# EAGLE design 1551H-RS485 to Neopixel with RJ45 (EAGLE 9.4.2)
RS485 over Ethernet to NeoPixel for Hammond 1551H enclosure
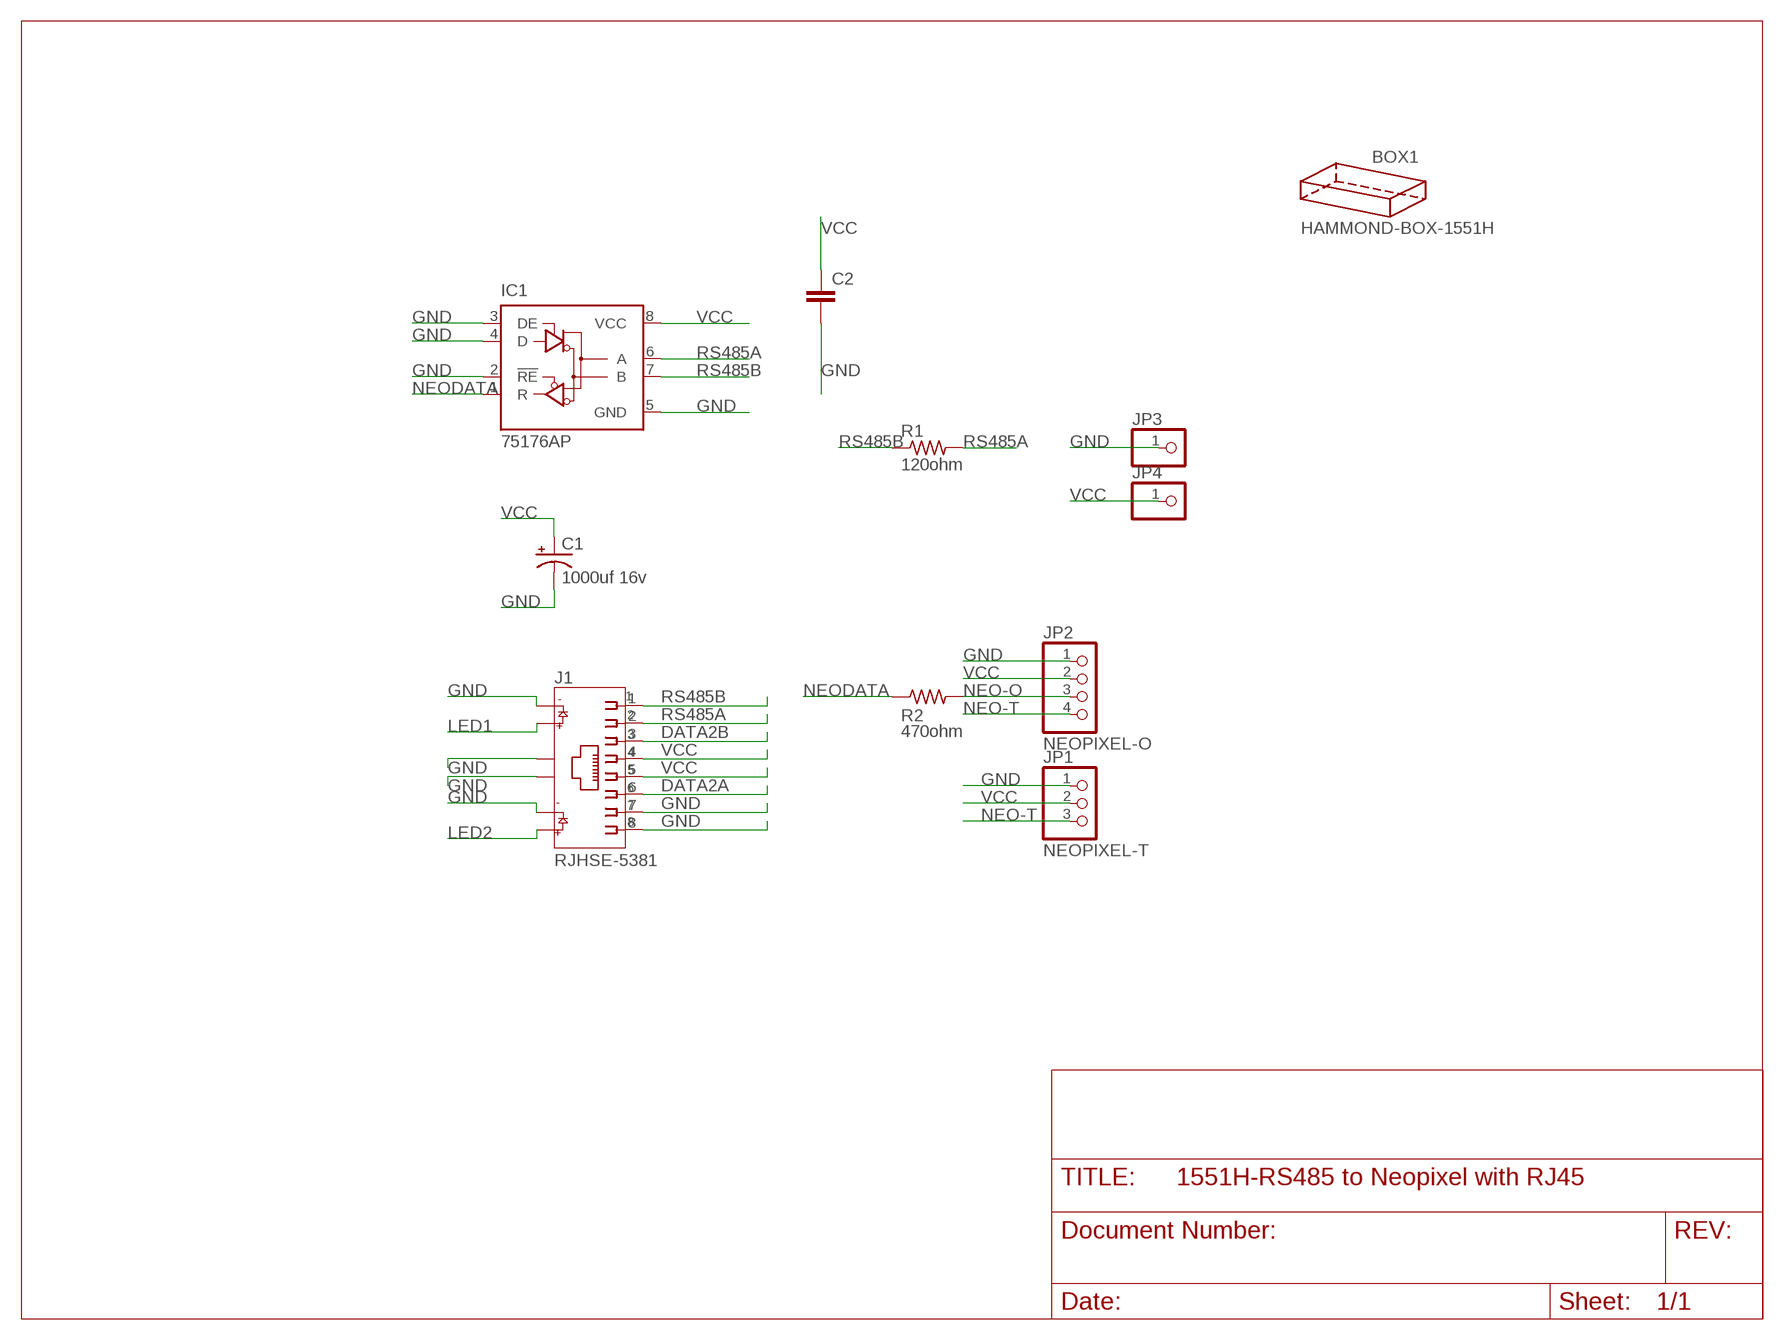
[diagram p0: schematic, sheet 1]

## Parts
BOX1  HAMMOND-BOX-1551H  [1551H]
C1  1000uf 16v  1000UF-RADIAL-5MM-25V-20%  [CPOL-RADIAL-5MM-10MM]
C2  CAPACITOR_0805_N  [RESC0805_N]
IC1  75176AP  [DIL08]
J1  RJHSE-5381  [AMPHENOL_RJHSE-5381]
JP1  NEOPIXEL-T  PINHD-1X3  [1X03]
JP2  NEOPIXEL-O  PINHD-1X4  [1X04]
JP3  PINHD-1X1  [1X01]
JP4  PINHD-1X1  [1X01]
R1  120ohm  R-US_R0805  [R0805]
R2  470ohm  R-US_R0805  [R0805]

## Nets
DATA2A: J1.6
DATA2B: J1.3
GND: C1.- C2.2 IC1.2(!RE) IC1.3(DE) IC1.4(D) IC1.5(GND) J1.7 J1.8 J1.9 J1.11 J1.S1 J1.S2 JP1.1 JP2.1 JP3.1
LED1: J1.10
LED2: J1.12
NEO-O: JP2.3 R2.2
NEO-T: JP1.3 JP2.4
NEODATA: IC1.1(R) R2.1
RS485A: IC1.6(A) J1.2 R1.2
RS485B: IC1.7(B) J1.1 R1.1
VCC: C1.+ C2.1 IC1.8(VCC) J1.4 J1.5 JP1.2 JP2.2 JP4.1

## Library data of the parts
BOX1 = hammond:HAMMOND-BOX: Hammond Project boxes Hammond 1551 Transluscent Blue 50x35x20mm 1551GTBU http://www.hammondmfg.com/pdf/1551G.pdf Hammond 1551 Transluscent Blue 50x50x20mm 1551RTBU http://www.hammondmfg.com/pdf/1551R.pdf Hammond 1551 Transluscent Blue 60x35x20mm 1551HTBU http://www.hammondmfg.com/pdf/1551H.pdf Hammond 1551 Transluscent Blue 80x40x20mm 1551KTBU http://www.hammondmfg.com/pdf/1551K.pdf Hammond 1591 Transluscent Blue 100x51x22mm 1591XXATBU http://www.hammondmfg.com/pdf/1591XXA.pdf Hammond 1553B 117x79x24mm 1553B__BK http://www.hammondmfg.com/pdf/1553B.pdf Hammond 1553D 147x78x24mm 1553B__BK http://www.hammondmfg.com/pdf/1553C.pdf
C1 = SparkFun-Capacitors:1000UF: 1,000µF/1mF ceramic capacitors A capacitor is a passive two-terminal electrical component used to store electrical energy temporarily in an electric field. CAP-08070; PROD_ID: CAP-09538; VALUE: 1mF
C2 = Nordic_nRF:CAPACITOR: Generic chip capacitor
IC1 = 751xx:75176A: DIFFERENTIAL BUS TRANSCEIVER Source: http://focus.ti.com/lit/ds/symlink/sn75176a.pdf
J1 = RJHSE-5381:RJHSE-5381: connector, mod jack, rt angle pcb, shielded, led1-g, led2-y, single port, rj-45 8 cont; AVAILABILITY: Unavailable; DESCRIPTION: connector, mod jack, rt angle pcb, shielded, led1-g, led2-y, single port, rj-45 8 cont; MF: Amphenol ICC; MP: RJHSE-5381; PACKAGE: None; PRICE: None
JP1 = pinhead:PINHD-1X3: PIN HEADER
JP2 = pinhead:PINHD-1X4: PIN HEADER
JP3 JP4 = pinhead:PINHD-1X1: PIN HEADER
R1 R2 = rcl:R-US_: RESISTOR, American symbol; SPICEPREFIX: R

## Board
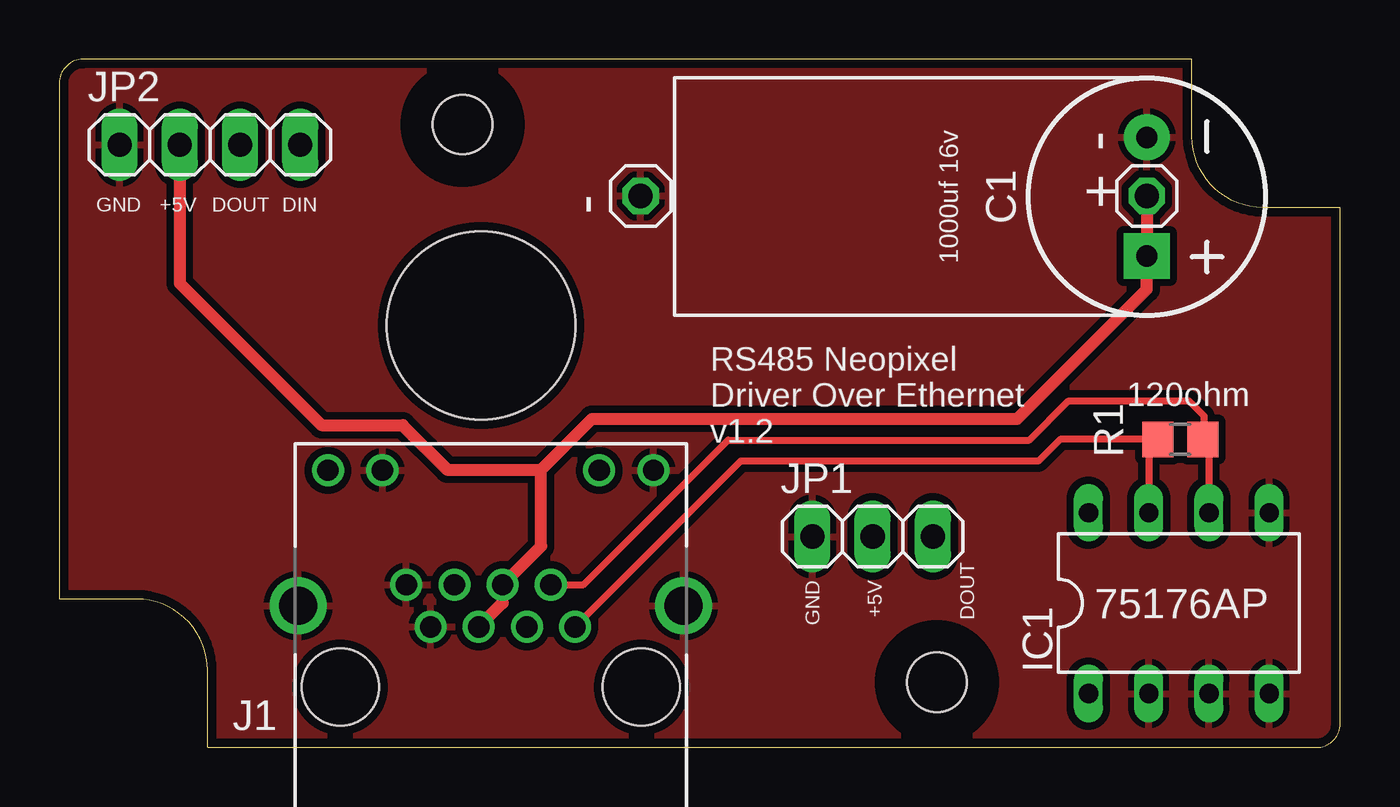
[diagram p1: board, top side]
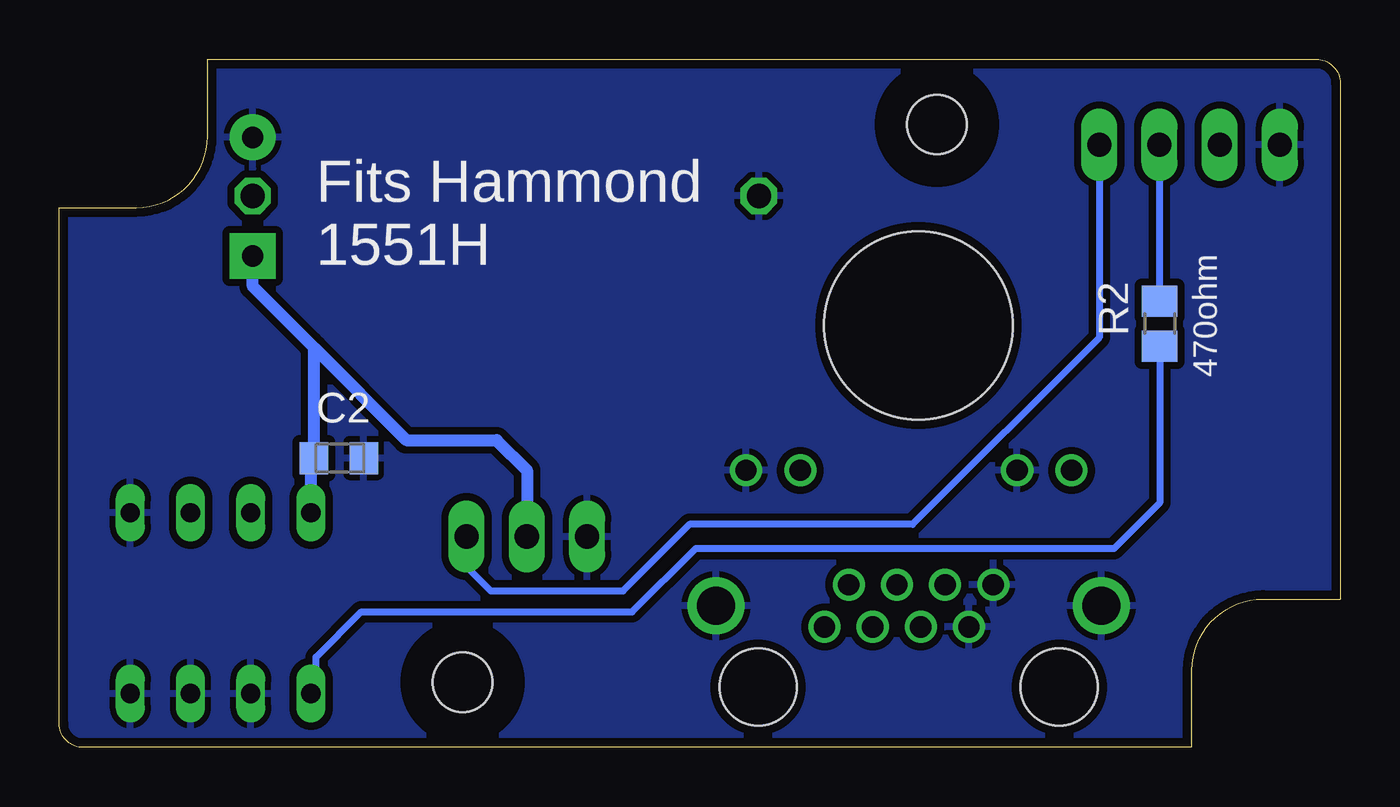
[diagram p2: board, bottom side, seen from below]

Size 54 x 29 mm. Coordinates in mm from the lower left corner, seen from the top.
Copper layers (1*16): Top 0.035559375mm / dielectric 1.6mm / Bottom 0.035559375mm
Design rules "oshpark-2layer": minimum track width 6mil, minimum drill 10mil, track to track 6mil, track to pad 6mil, pad to pad 6mil, via to via 6mil, smd to smd 6mil, copper to edge 15mil, drill to drill 6mil, minimum pad ring 5mil, minimum via ring 5mil, stop-mask expansion 2.5mil, vias tented up to drill 0mil, thermal gap 10mil
Holes 7.94 mm at 17.78,17.78

### Footprints (pad centres in the part's own frame; a part is rotated, then mirrored left to right if it is on the bottom)
1551H = hole 2.5: 37,2.75; 17,26.25
CPOL-RADIAL-5MM-10MM = drill 0.9 pad 1.93 square: + 2.5,0 | drill 0.9 pad 1.93: - -2.5,0
RESC0805_N = smd 1.2 x 1.35: 1 -1.1,0; 2 1,0
DIL08 = drill 0.813 long: 1 -3.81,-3.81; 2 -1.27,-3.81; 3 1.27,-3.81; 4 3.81,-3.81; 5 3.81,3.81; 6 1.27,3.81; 7 -1.27,3.81; 8 -3.81,3.81
AMPHENOL_RJHSE-5381 = drill 0.9: 1 3.55,2.54; 2 2.53,4.32; 3 1.52,2.54; 4 0.5,4.32; 5 -0.51,2.54; 6 -1.53,4.32; 7 -2.54,2.54; 8 -3.56,4.32; 9 6.86,9.14; 10 4.57,9.14; 11 -4.57,9.14; 12 -6.86,9.14 | drill 1.6: S1 8.13,3.43; S2 -8.13,3.43 | hole 3.25: 6.35,0; -6.35,0
1X03 = drill 1.016 long: 1 -2.54,0; 2 0,0; 3 2.54,0
1X04 = drill 1.016 long: 1 -3.81,0; 2 -1.27,0; 3 1.27,0; 4 3.81,0
1X01 = drill 1.016 octagon: 1 0,0
R0805 = smd 1.3 x 1.5: 1 -0.95,0; 2 0.95,0

### Placement (x,y rotation side)
BOX1  0,0 0 top
C1  45.85,23.21 270 top
C2  42.16,12.19 0 bottom
IC1  47.2,6.08 0 top
J1  18.19,2.54 0 top
JP1  34.29,8.89 0 top
JP2  6.35,25.4 0 top
JP3  24.51,23.24 0 top
JP4  45.85,23.24 0 top
R1  47.26,12.98 0 top
R2  7.61,17.86 90 bottom

### Tracks (layer width: path | path; a pad name or v marks a point on that pad's centre or on a via)
GND
  pour Bottom (isolate 0.305): 0,29.21 54.61,29.21 54.61,3.81 55.88,2.54 55.88,0 0,0
  pour Top (isolate 0.305): 0,29.21 54.61,29.21 54.61,0 0,0
NEO-O
  Bottom 0.305: R2.2 7.62,18.82 JP2.3
NEO-T
  Bottom 0.305: JP2.4 10.16,17.27 18.03,9.4 27.43,9.4 30.23,6.6 35.81,6.6 36.83,7.62 JP1.3
NEODATA
  Bottom 0.305: R2.1 7.61,10.31 9.53,8.38 27.18,8.38 29.84,5.71 41.27,5.71 43.18,3.81 43.18,2.48 IC1.1
RS485A
  Top 0.305: J1.2 22.1,6.86 28.19,12.95 40.89,12.95 42.55,14.61 47.62,14.61 48.26,13.97 48.26,13.04 R1.2 48.47,12.72 IC1.6
RS485B
  Top 0.305: J1.1 28.73,12.06 41.27,12.06 42.2,12.98 R1.1 45.93,12.61 IC1.7
VCC
  Top 0.508: J1.5 18.69,6.09 J1.4 20.32,8.49 20.32,11.69 | 20.32,11.69 22.47,13.84 40.39,13.84 45.85,19.3 C1.+ JP4.1 | 20.32,11.69 16.37,11.69 14.48,13.59 11.05,13.59 5.08,19.56 JP2.2
  Bottom 0.508: C1.+ 45.85,19.43 43.43,17.02 43.26,16.85 | 43.26,16.85 39.37,12.95 35.56,12.95 34.29,11.68 JP1.2 | IC1.8 43.39,12.07 C2.1 43.26,16.85

### Text on the board
tNames: - | GND | +5V | DOUT | DIN | + | - | RS485 Neopixel / Driver Over Ethernet / v1.2 | DOUT | GND | +5V
bNames: Fits Hammond / 1551H